# Altium schematic sheet Sensor.SchDoc
size A
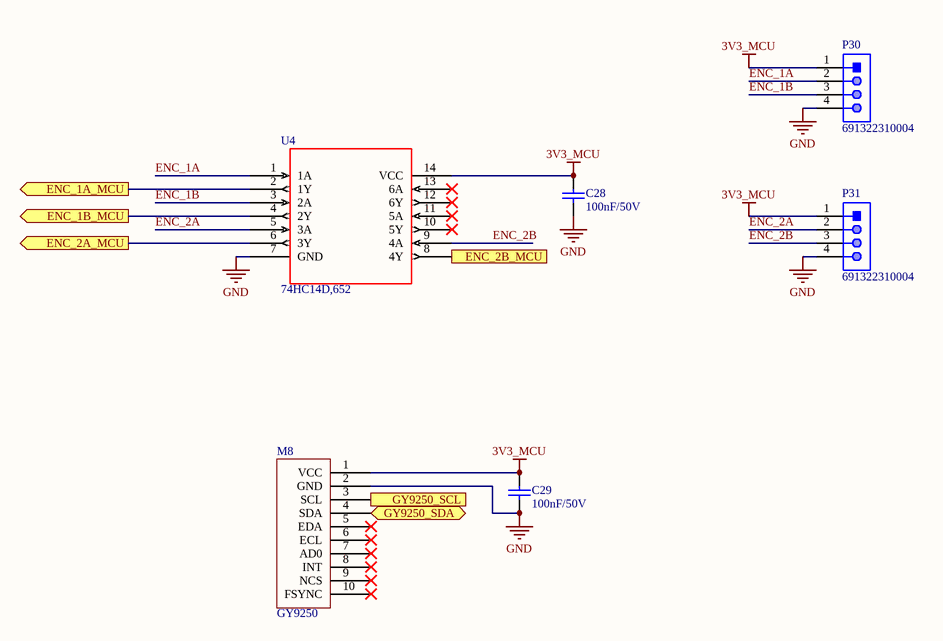
[diagram p0: Sensor.SchDoc]

## Parts
C28  value 100nF/50V  [CAP-SM-0805]  (hidden comment: Cap-100nF-50V-0805)
C29  value 100nF/50V  [CAP-SM-0805]  (hidden comment: Cap-100nF-50V-0805)
M8  GY9250  [GY9250]
P30  691322310004  [691322310004]
P31  691322310004  [691322310004]
U4  74HC14D,652  [74HC14D,652]

## Ports
ENC_1A_MCU (out), ENC_1B_MCU (out), ENC_2A_MCU (out), ENC_2B_MCU (out), GY9250_SCL (in), GY9250_SDA (bidir)

## Nets
3V3_MCU: C28.2 C29.2 M8.1(VCC) P30.1 P31.1 U4.14(VCC)
GND: C28.1 C29.1 M8.2(GND) P30.4 P31.4 U4.7(GND)
ENC_1A: P30.2 U4.1(1A)
ENC_1A_MCU: U4.2(1Y) ; port ENC_1A_MCU
ENC_1B: P30.3 U4.3(2A)
ENC_1B_MCU: U4.4(2Y) ; port ENC_1B_MCU
ENC_2A: P31.2 U4.5(3A)
ENC_2A_MCU: U4.6(3Y) ; port ENC_2A_MCU
ENC_2B: P31.3 U4.9(4A)
ENC_2B_MCU: U4.8(4Y) ; port ENC_2B_MCU
GY9250_SCL: M8.3(SCL) ; port GY9250_SCL
GY9250_SDA: M8.4(SDA) ; port GY9250_SDA

Not connected (* = marked no-connect by the designer): M8 5(EDA)* 6(ECL)* 7(AD0)* 8(INT)* 9(NCS)* 10(FSYNC)*; U4 10(5Y)* 11(5A)* 12(6Y)* 13(6A)*

## Library data of the parts
C28 C29 = Cap-100nF-50V-0805: CAP CER 0.1UF 50V Y5V 0805; Manufacturer: Samsung Electro-Mechanics; Manufacturer Part Number: CL21F104ZBCNNNC; Local Supplier: thegioiic; Local Supplier Link: https://thegioiic.com/products/tu-100nf-0-1uf-50v-0805; Supplier 1: Digikey; Supplier 1 Part Number: 1276-1007-1-ND; Supplier 1 Link: https://www.digikey.com/product-detail/en/samsung-electro-mechanics/CL21F104ZBCNNNC/1276-1007-1-ND/3889093
P30 P31 = 691322310004: WR-TBL Serie 322 Horizontal PCB Header, Pluggable, pitch 3.81mm, 4p; Compliance: RoHS; Modularity: No; Pin Number: 4; Rated Current [UL]: 10A; Working Voltage [UL]: 300VAC; ComponentLink1Description: Manufacturer; ComponentLink1URL: http://www.we-online.de; ComponentLink2URL: https://katalog.we-online.de/em/datasheet/691322310004.pdf; ComponentLink2Description: Datasheet; Mounting Technology: THT; Part Number: 691322310004; Packaging: Box; Operating Temperature: -40 to +105degC; PCB/Cable/Panel: PCB; Pitch: 3.81mm; Published Date: October 2019; Type: Horizontal; Publisher: Wurth Elektronik; Application: Pluggable
U4 = 74HC14D,652: No Description Available; Vendor: Nexperia; SourceLibrary: Nexperia_2018-05-2018; Manufacturer_Part_Number: 74HC14D,652; Copyright: Copyright (C) 2016 Accelerated Designs. All rights reserved; RefDes: RefDes; Type: DEV
M8 = GY9250: Local Supplier: HShop; Local Supplier Link: https://hshop.vn/products/cam-bien-gy-9250-9dof-imu-mpu9250; Local Supplier Part Number: *; Manufacturer: *; Manufacturer Part Number: *